# Altium schematic sheet power.SchDoc
size 420 x 297 mm; Address1: Address1; Address2: Address2; Address3: Address3; Address4: Address4; SheetNumber: 3; SheetTotal: 6
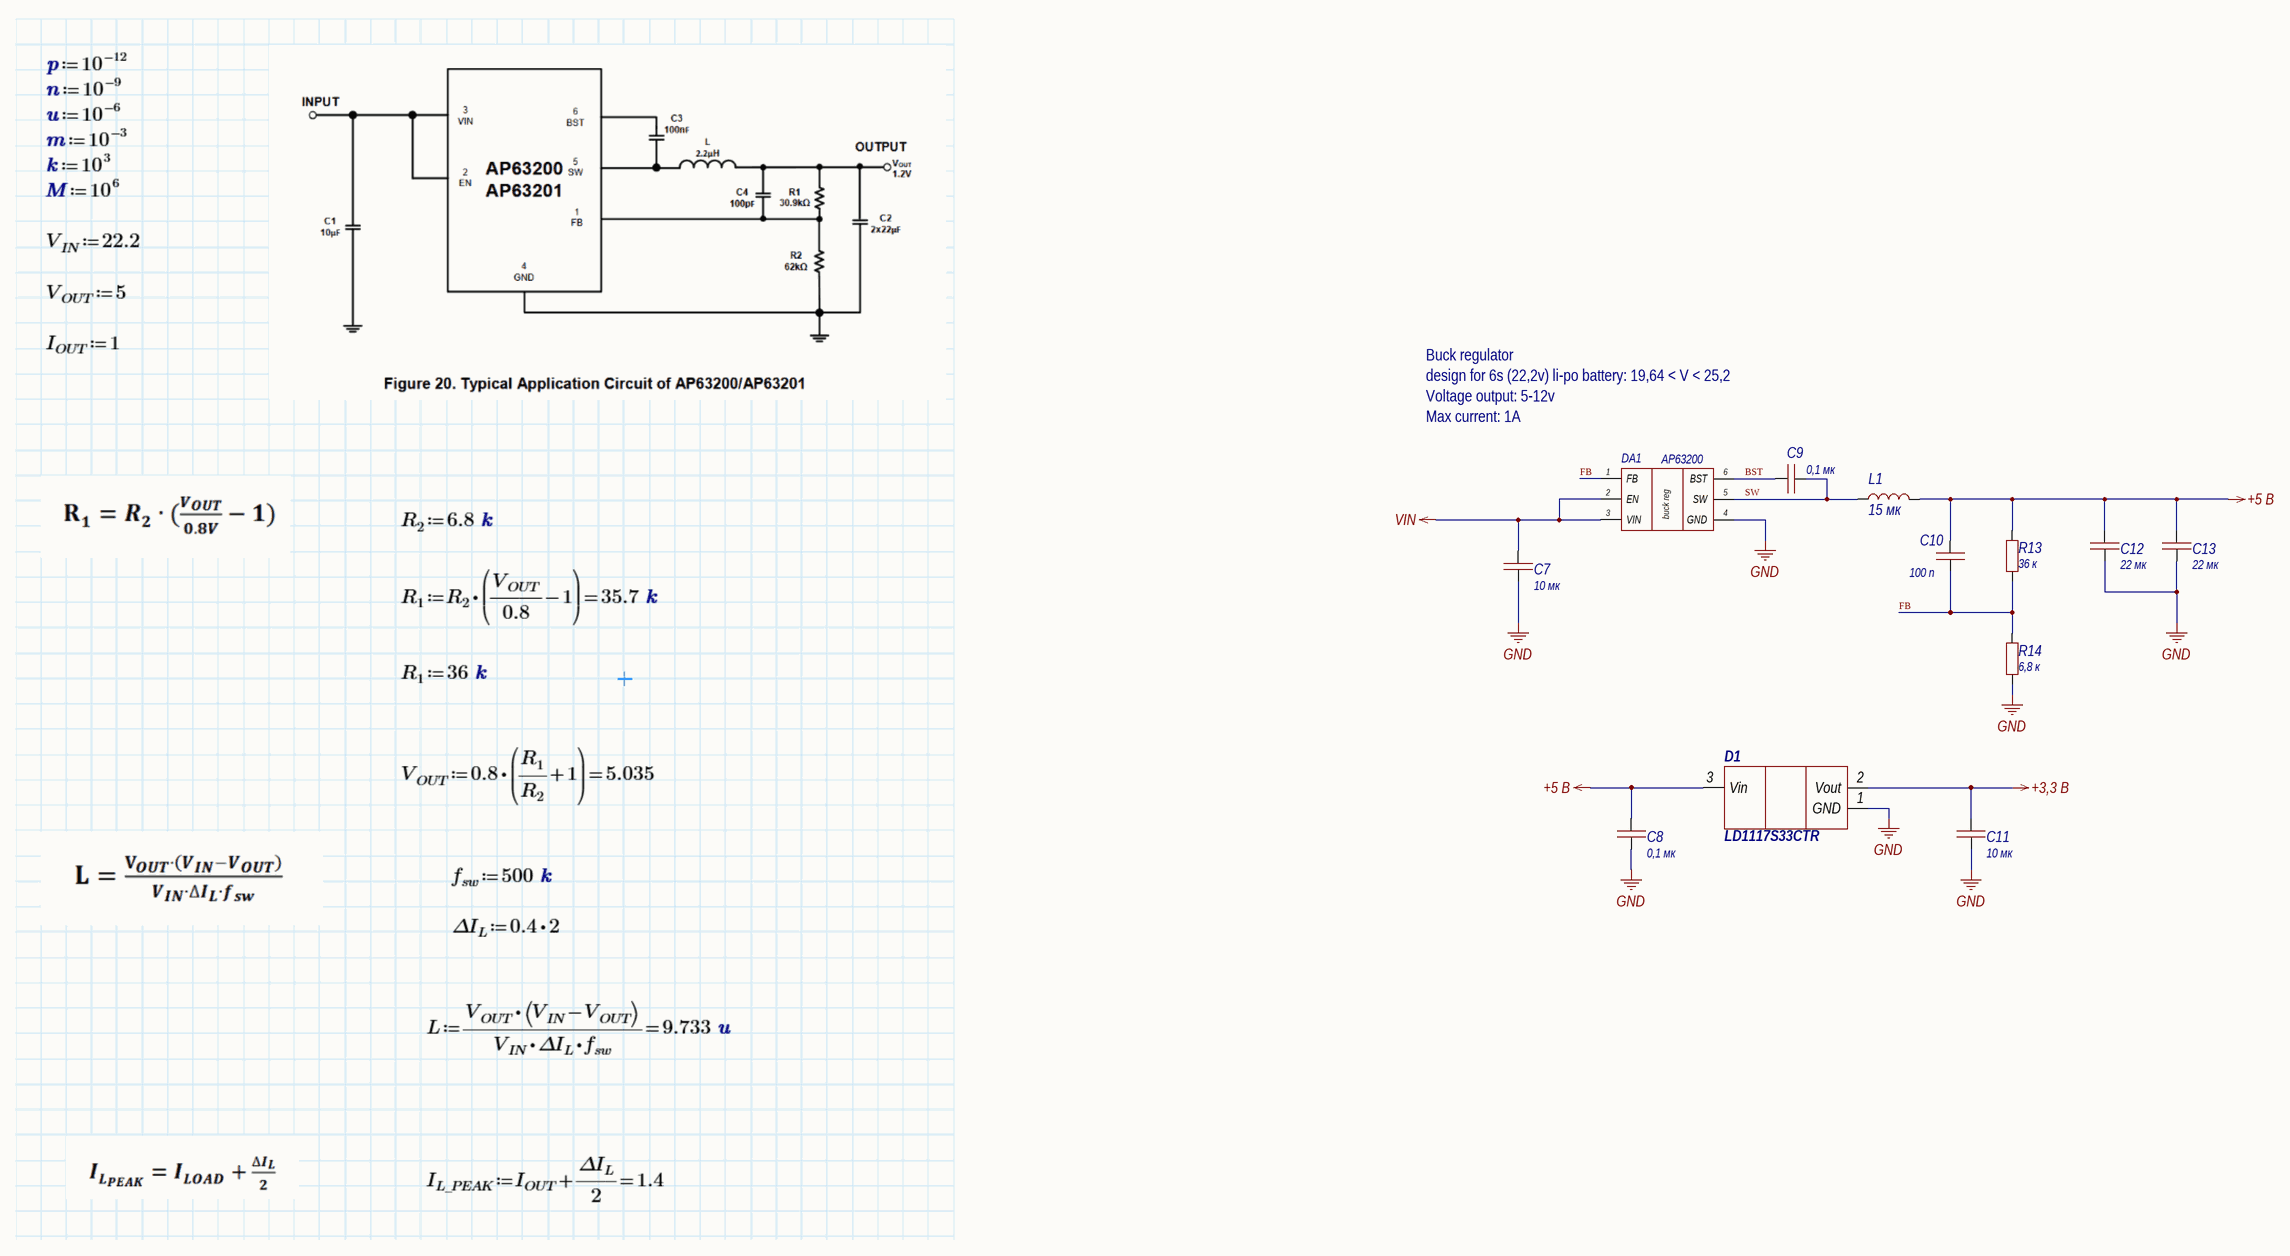
[diagram p0: power.SchDoc]

## Parts
C7  value 10 мк  [1210C]  (hidden comment: Capacitor)
C8  value 0,1 мк  [0603C]  (hidden comment: Capacitor)
C9  value 0,1 мк  [0603C]  (hidden comment: Capacitor)
C10  value 100 п  [0603C]  (hidden comment: Capacitor)
C11  value 10 мк  [1210C]  (hidden comment: Capacitor)
C12  value 22 мк  [1210C]  (hidden comment: Capacitor)
C13  value 22 мк  [1210C]  (hidden comment: Capacitor)
D1  LD1117S33CTR  [SOT223]
DA1  AP63200  [TSOT26]
L1  value 15 мк  [SP43]  (hidden comment: SP43-150K)
R13  value 36 к  [0603R]  (hidden comment: Resistor)
R14  value 6,8 к  [0603R]  (hidden comment: Resistor)

## Nets
+3,3 В: C11.2 D1.2(Vout)
+5 В: C8.2 C10.2 C12.2 C13.2 D1.3(Vin) L1.2 R13.2
GND: C7.1 C8.1 C11.1 C12.1 C13.1 D1.1(GND) DA1.4(GND) R14.1
VIN: C7.2 DA1.2(EN) DA1.3(VIN)
BST: C9.1 DA1.6(BST)
FB: C10.1 DA1.1(FB) R13.1 R14.2
SW: C9.2 DA1.5(SW) L1.1

## Notes on the sheet
- Buck regulator
- design for 6s (22,2v) li-po battery: 19,64 < V < 25,2
- Voltage output: 5-12v
- Max current: 1A
- Перв. примен.
- Справ. №
- Подп. и дата
- Инв. № дубл.
- Взам. инв. №
- Разраб.
- Изм.
- Лист
- № докум.
- Подп.
- Дата
- Лит.
- Масса
- Масштаб
- Пров.
- Т.контр.
- Схема электрическая принципиальная
- Листов
- Инв. № подл.
- Утв.
- Н.контр.
- Копировал
- Формат А3
- (in symbol AP63200) buck reg

## Library data of the parts
C7 = Capacitor_10u_10_35V_X7R_1210C: Конденсатор 1210C ёмкостью 10 мк 10%, 35 В, X7R; Library Path2: Schematic\Capacitor.SchLib; Voltage (V): 35; Capacity (nF): 10000; Part Number: Capacitor_10u_10_35V_X7R_1210C; Tolerance: 10%; Dielectric: X7R
C8 = Capacitor_0,1u_10_50V_X7R_0603C: Конденсатор 0603C ёмкостью 0,1 мк 10%, 50 В, X7R; Voltage (V): 50; Capacity (nF): 100; Part Number: Capacitor_0,1u_10_50V_X7R_0603C; Tolerance: 10%; Dielectric: X7R
C9 = Capacitor_0,1u_10_50V_X7R_0603C: Конденсатор 0603C ёмкостью 0,1 мк 10%, 50 В, X7R; Library Path2: Schematic\Capacitor.SchLib; Voltage (V): 50; Capacity (nF): 100; Part Number: Capacitor_0,1u_10_50V_X7R_0603C; Tolerance: 10%; Dielectric: X7R
C10 = Capacitor_100p_10_50V_X7R_0603C: Конденсатор 0603C ёмкостью 100 п 10%, 50 В, X7R; Library Path2: Schematic\Capacitor.SchLib; Voltage (V): 50; Capacity (nF): 0,1; Part Number: Capacitor_100p_10_50V_X7R_0603C; Tolerance: 10%; Dielectric: X7R
C11 = Capacitor_10u_10_35V_X7R_1210C: Конденсатор 1210C ёмкостью 10 мк 10%, 35 В, X7R; Voltage (V): 35; Capacity (nF): 10000; Part Number: Capacitor_10u_10_35V_X7R_1210C; Tolerance: 10%; Dielectric: X7R
C12 C13 = Capacitor_22u_10_25V_X7R_1210C: Конденсатор 1210C ёмкостью 22 мк 10%, 25 В, X7R; Library Path2: Schematic\Capacitor.SchLib; Voltage (V): 25; Capacity (nF): 22000; Part Number: Capacitor_22u_10_25V_X7R_1210C; Tolerance: 10%; Dielectric: X7R
D1 = LD1117S33CTR: Линейный стабилизатор напряжения; Part Number: LD1117S33CTR
DA1 = AP63200: DC-DC понижающий преобразователь, Vin: 3.8 - 40 В, adj, 2 А; Part Number: AP63200
L1 = SP43-150K: Индуктивность на 15 мкГн, номинальный ток 1,3 А; Inductance (μH): 15; Current (A): 1,3; Part Number: SP43-150K
R13 = Resistor_36k_1_0603: Резистор номиналом 36 кОм 1%; Power: *; Part Number: Resistor_36k_1_0603; Tolerance: 1%
R14 = Resistor_6.8k_1_0603: Резистор номиналом 6,8 кОм 1%; Power: *; Part Number: Resistor_6.8k_1_0603; Tolerance: 1%